# Altium schematic sheet FPGA_Project1.SchDoc
size A4
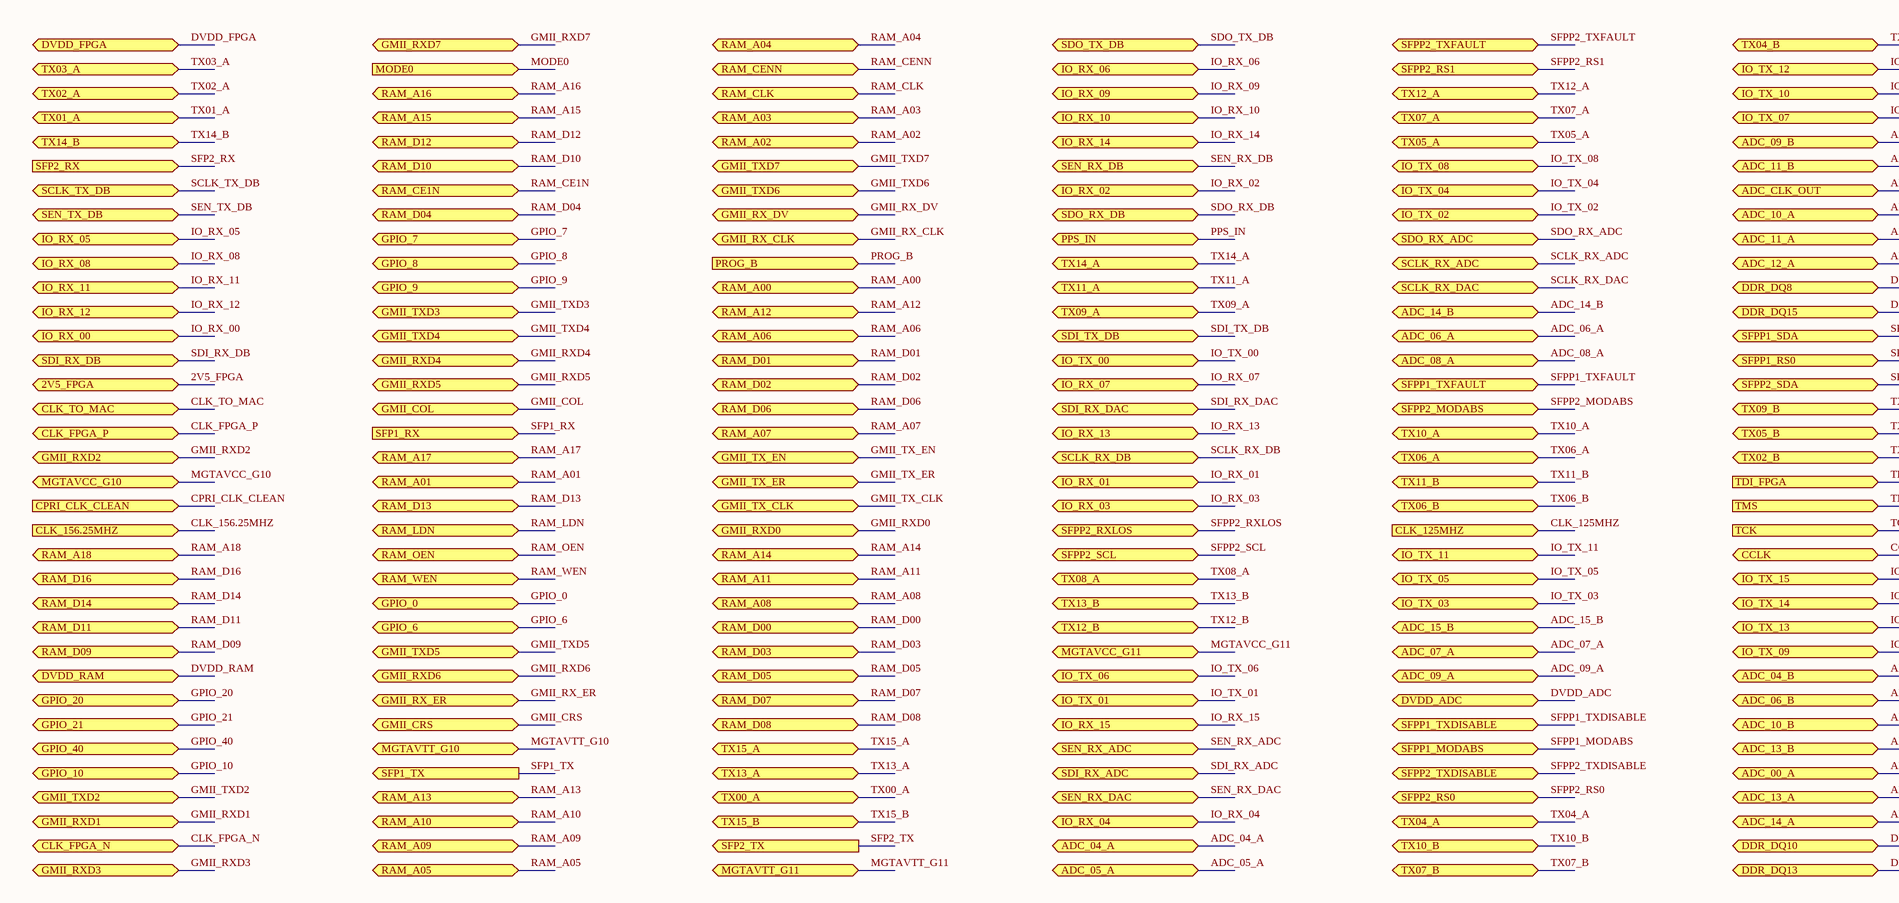
[diagram p0: FPGA_Project1.SchDoc, left]
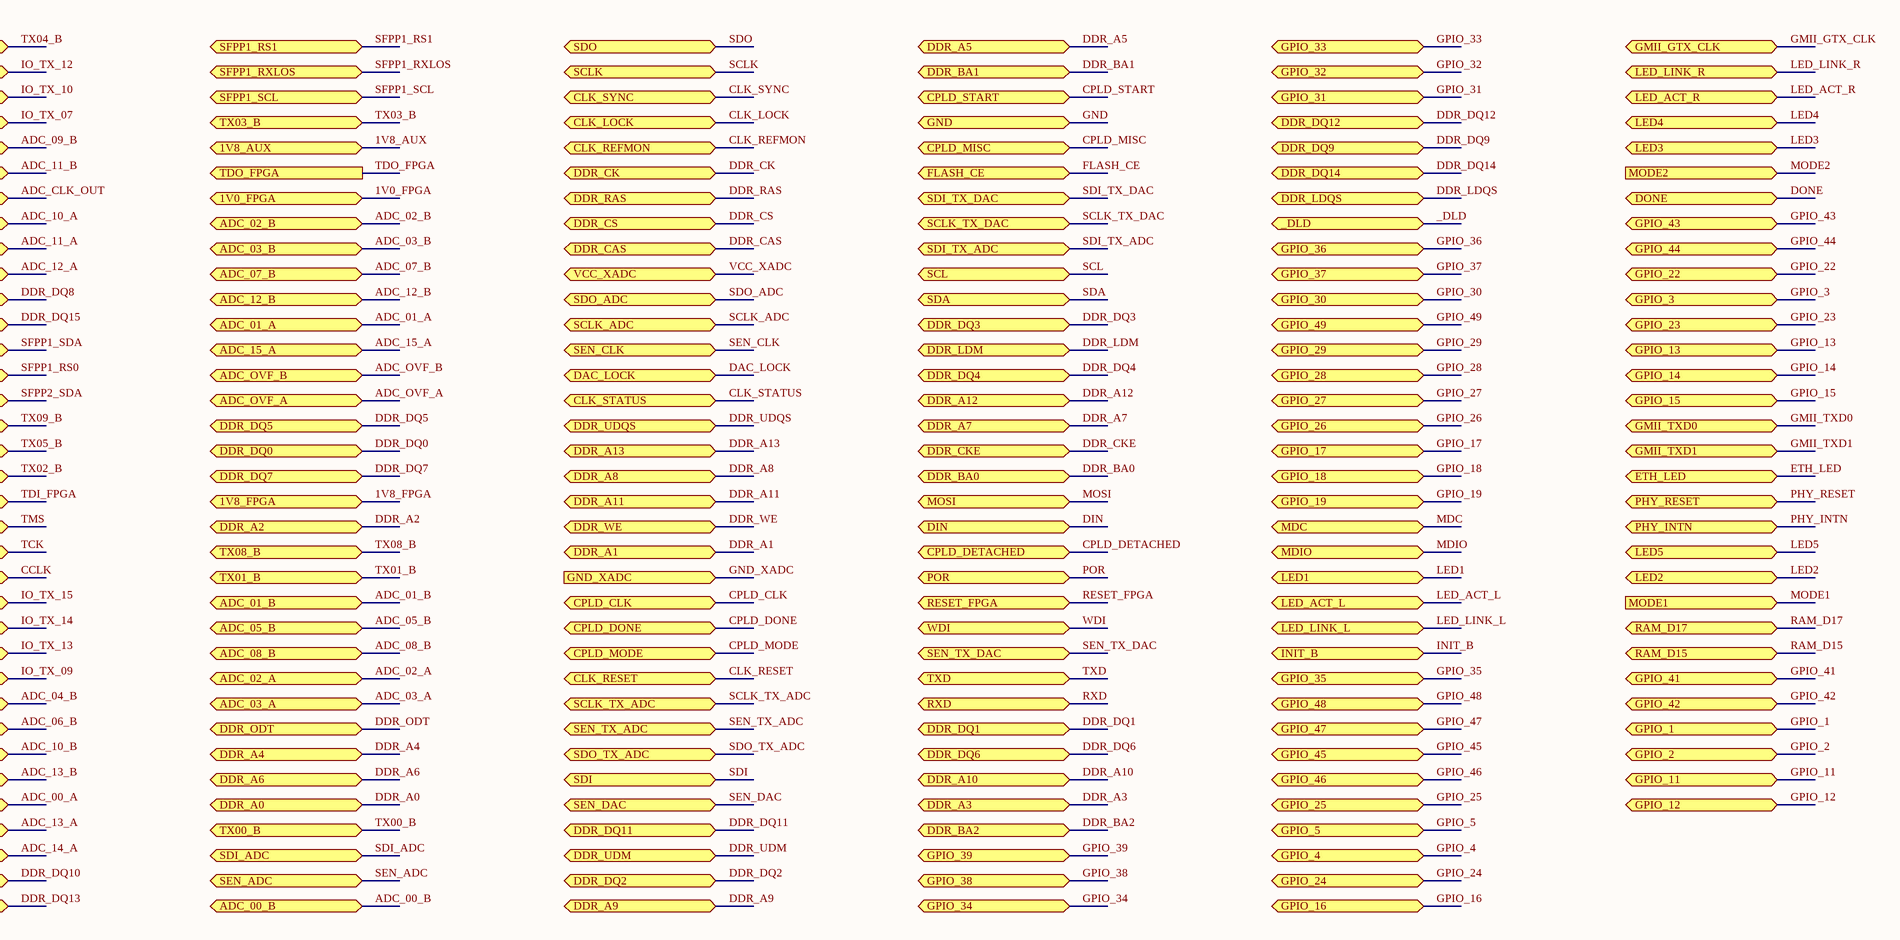
[diagram p1: FPGA_Project1.SchDoc, right]

## Ports
1V0_FPGA, 1V8_AUX, 1V8_FPGA, 2V5_FPGA, _DLD (bidir), ADC_00_A (bidir), ADC_00_B (bidir), ADC_01_A (bidir), ADC_01_B (bidir), ADC_02_A (bidir), ADC_02_B (bidir), ADC_03_A (bidir), ADC_03_B (bidir), ADC_04_A (bidir), ADC_04_B (bidir), ADC_05_A (bidir), ADC_05_B (bidir), ADC_06_A (bidir), ADC_06_B (bidir), ADC_07_A (bidir), ADC_07_B (bidir), ADC_08_A (bidir), ADC_08_B (bidir), ADC_09_A (bidir), ADC_09_B (bidir), ADC_10_A (bidir), ADC_10_B (bidir), ADC_11_A (bidir), ADC_11_B (bidir), ADC_12_A (bidir), ADC_12_B (bidir), ADC_13_A (bidir), ADC_13_B (bidir), ADC_14_A (bidir), ADC_14_B (bidir), ADC_15_A (bidir), ADC_15_B (bidir), ADC_CLK_OUT (bidir), ADC_OVF_A (bidir), ADC_OVF_B (bidir), CCLK (bidir), CLK_125MHZ (in), CLK_156.25MHZ (in), CLK_FPGA_N (bidir), CLK_FPGA_P (bidir), CLK_LOCK (bidir), CLK_REFMON (bidir), CLK_RESET (bidir), CLK_STATUS (bidir), CLK_SYNC (bidir), CLK_TO_MAC (bidir), CPLD_CLK (bidir), CPLD_DETACHED (bidir), CPLD_DONE (bidir), CPLD_MISC (bidir), CPLD_MODE (bidir), CPLD_START (bidir), CPRI_CLK_CLEAN (in), DAC_LOCK (bidir), DDR_A0 (bidir), DDR_A1 (bidir), DDR_A2 (bidir), DDR_A3 (bidir), DDR_A4 (bidir), DDR_A5 (bidir), DDR_A6 (bidir), DDR_A7 (bidir), DDR_A8 (bidir), DDR_A9 (bidir), DDR_A10 (bidir), DDR_A11 (bidir), DDR_A12 (bidir), DDR_A13 (bidir), DDR_BA0 (bidir), DDR_BA1 (bidir), DDR_BA2 (bidir), DDR_CAS (bidir), DDR_CK (bidir), DDR_CKE (bidir), DDR_CS (bidir), DDR_DQ0 (bidir), DDR_DQ1 (bidir), DDR_DQ2 (bidir), DDR_DQ3 (bidir), DDR_DQ4 (bidir), DDR_DQ5 (bidir), DDR_DQ6 (bidir), DDR_DQ7 (bidir), DDR_DQ8 (bidir), DDR_DQ9 (bidir), DDR_DQ10 (bidir), DDR_DQ11 (bidir), DDR_DQ12 (bidir), DDR_DQ13 (bidir), DDR_DQ14 (bidir), DDR_DQ15 (bidir), DDR_LDM (bidir), DDR_LDQS (bidir), DDR_ODT (bidir), DDR_RAS (bidir), DDR_UDM (bidir), DDR_UDQS (bidir), DDR_WE (bidir), DIN (bidir), DONE (bidir), DVDD_ADC, DVDD_FPGA, DVDD_RAM, ETH_LED (bidir), FLASH_CE (bidir), GMII_COL (bidir), GMII_CRS (bidir), GMII_GTX_CLK (bidir), GMII_RX_CLK (bidir), GMII_RX_DV (bidir), GMII_RX_ER (bidir), GMII_RXD0 (bidir), GMII_RXD1 (bidir), GMII_RXD2 (bidir), GMII_RXD3 (bidir), GMII_RXD4 (bidir), GMII_RXD5 (bidir), GMII_RXD6 (bidir), GMII_RXD7 (bidir), GMII_TX_CLK (bidir), GMII_TX_EN (bidir), GMII_TX_ER (bidir), GMII_TXD0 (bidir), GMII_TXD1 (bidir), GMII_TXD2 (bidir), GMII_TXD3 (bidir), GMII_TXD4 (bidir), GMII_TXD5 (bidir), GMII_TXD6 (bidir), GMII_TXD7 (bidir), GND (bidir), GND_XADC (in), GPIO_0 (bidir), GPIO_1 (bidir), GPIO_2 (bidir), GPIO_3 (bidir), GPIO_4 (bidir), GPIO_5 (bidir), GPIO_6 (bidir), GPIO_7 (bidir), GPIO_8 (bidir), GPIO_9 (bidir), GPIO_10 (bidir), GPIO_11 (bidir), GPIO_12 (bidir), GPIO_13 (bidir), GPIO_14 (bidir), GPIO_15 (bidir), GPIO_16 (bidir), GPIO_17 (bidir), GPIO_18 (bidir), GPIO_19 (bidir), GPIO_20 (bidir), GPIO_21 (bidir), GPIO_22 (bidir), GPIO_23 (bidir), GPIO_24 (bidir), GPIO_25 (bidir), GPIO_26 (bidir), GPIO_27 (bidir), GPIO_28 (bidir), GPIO_29 (bidir), GPIO_30 (bidir), GPIO_31 (bidir), GPIO_32 (bidir), GPIO_33 (bidir), GPIO_34 (bidir), GPIO_35 (bidir), GPIO_36 (bidir), GPIO_37 (bidir), GPIO_38 (bidir), GPIO_39 (bidir), GPIO_40 (bidir), GPIO_41 (bidir), GPIO_42 (bidir), GPIO_43 (bidir), GPIO_44 (bidir), GPIO_45 (bidir), GPIO_46 (bidir), GPIO_47 (bidir), GPIO_48 (bidir), GPIO_49 (bidir), INIT_B (bidir), IO_RX_00 (bidir), IO_RX_01 (bidir), IO_RX_02 (bidir), IO_RX_03 (bidir), IO_RX_04 (bidir), IO_RX_05 (bidir), IO_RX_06 (bidir), IO_RX_07 (bidir), IO_RX_08 (bidir), IO_RX_09 (bidir), IO_RX_10 (bidir), IO_RX_11 (bidir), IO_RX_12 (bidir), IO_RX_13 (bidir), IO_RX_14 (bidir), IO_RX_15 (bidir), IO_TX_00 (bidir), IO_TX_01 (bidir), IO_TX_02 (bidir), IO_TX_03 (bidir), IO_TX_04 (bidir), IO_TX_05 (bidir), IO_TX_06 (bidir), IO_TX_07 (bidir), IO_TX_08 (bidir), IO_TX_09 (bidir), IO_TX_10 (bidir), IO_TX_11 (bidir), IO_TX_12 (bidir), IO_TX_13 (bidir), IO_TX_14 (bidir), IO_TX_15 (bidir), LED1 (bidir), LED2 (bidir), LED3 (bidir), LED4 (bidir), LED5 (bidir), LED_ACT_L (bidir), LED_ACT_R (bidir), LED_LINK_L (bidir), LED_LINK_R (bidir), MDC (bidir), MDIO (bidir), MGTAVCC_G10, MGTAVCC_G11, MGTAVTT_G10, MGTAVTT_G11, MODE0 (in), MODE1 (in), MODE2 (in), MOSI (bidir), PHY_INTN (bidir), PHY_RESET (bidir), POR (bidir), PPS_IN (bidir), PROG_B (in), RAM_A00 (bidir), RAM_A01 (bidir), RAM_A02 (bidir), RAM_A03 (bidir), RAM_A04 (bidir), RAM_A05 (bidir), RAM_A06 (bidir), RAM_A07 (bidir), RAM_A08 (bidir), RAM_A09 (bidir), RAM_A10 (bidir), RAM_A11 (bidir), RAM_A12 (bidir), RAM_A13 (bidir), RAM_A14 (bidir), RAM_A15 (bidir), RAM_A16 (bidir), RAM_A17 (bidir), RAM_A18 (bidir), RAM_CE1N (bidir), RAM_CENN (bidir), RAM_CLK (bidir), RAM_D00 (bidir), RAM_D01 (bidir), RAM_D02 (bidir), RAM_D03 (bidir), RAM_D04 (bidir), RAM_D05 (bidir), RAM_D06 (bidir), RAM_D07 (bidir), RAM_D08 (bidir), RAM_D09 (bidir), RAM_D10 (bidir), RAM_D11 (bidir), RAM_D12 (bidir), RAM_D13 (bidir), RAM_D14 (bidir), RAM_D15 (bidir), RAM_D16 (bidir), RAM_D17 (bidir), RAM_LDN (bidir), RAM_OEN (bidir), RAM_WEN (bidir), RESET_FPGA (bidir), RXD (bidir), SCL (bidir), SCLK (bidir), SCLK_ADC (bidir), SCLK_RX_ADC (bidir), SCLK_RX_DAC (bidir), SCLK_RX_DB (bidir), SCLK_TX_ADC (bidir), SCLK_TX_DAC (bidir), SCLK_TX_DB (bidir), SDA (bidir), SDI (bidir), SDI_ADC (bidir), SDI_RX_ADC (bidir), SDI_RX_DAC (bidir), SDI_RX_DB (bidir), SDI_TX_ADC (bidir), SDI_TX_DAC (bidir), SDI_TX_DB (bidir), SDO (bidir), SDO_ADC (bidir), SDO_RX_ADC (bidir), SDO_RX_DB (bidir), SDO_TX_ADC (bidir), SDO_TX_DB (bidir), SEN_ADC (bidir), SEN_CLK (bidir), SEN_DAC (bidir), SEN_RX_ADC (bidir), SEN_RX_DAC (bidir), SEN_RX_DB (bidir), SEN_TX_ADC (bidir), SEN_TX_DAC (bidir), SEN_TX_DB (bidir), SFP1_RX (in), SFP1_TX (out), SFP2_RX (in), SFP2_TX (out), SFPP1_MODABS (bidir), SFPP1_RS0 (bidir), SFPP1_RS1 (bidir), SFPP1_RXLOS (bidir), SFPP1_SCL (bidir), SFPP1_SDA (bidir), SFPP1_TXDISABLE (bidir), SFPP1_TXFAULT (bidir), SFPP2_MODABS (bidir), SFPP2_RS0 (bidir), SFPP2_RS1 (bidir), SFPP2_RXLOS (bidir), SFPP2_SCL (bidir), SFPP2_SDA (bidir), SFPP2_TXDISABLE (bidir), SFPP2_TXFAULT (bidir), TCK (in), TDI_FPGA (in), TDO_FPGA (out), TMS (in), TX00_A (bidir), TX00_B (bidir), TX01_A (bidir), TX01_B (bidir), TX02_A (bidir), TX02_B (bidir), TX03_A (bidir), TX03_B (bidir), TX04_A (bidir), TX04_B (bidir), TX05_A (bidir), TX05_B (bidir), TX06_A (bidir), TX06_B (bidir), TX07_A (bidir), TX07_B (bidir), TX08_A (bidir), TX08_B (bidir), TX09_A (bidir), TX09_B (bidir), TX10_A (bidir), TX10_B (bidir), TX11_A (bidir), TX11_B (bidir), TX12_A (bidir), TX12_B (bidir), TX13_A (bidir), TX13_B (bidir), TX14_A (bidir), TX14_B (bidir), TX15_A (bidir), TX15_B (bidir), TXD (bidir), VCC_XADC, WDI (bidir)

## Nets
1V0_FPGA: port 1V0_FPGA
1V8_AUX: port 1V8_AUX
1V8_FPGA: port 1V8_FPGA
2V5_FPGA: port 2V5_FPGA
_DLD: port _DLD
ADC_00_A: port ADC_00_A
ADC_00_B: port ADC_00_B
ADC_01_A: port ADC_01_A
ADC_01_B: port ADC_01_B
ADC_02_A: port ADC_02_A
ADC_02_B: port ADC_02_B
ADC_03_A: port ADC_03_A
ADC_03_B: port ADC_03_B
ADC_04_A: port ADC_04_A
ADC_04_B: port ADC_04_B
ADC_05_A: port ADC_05_A
ADC_05_B: port ADC_05_B
ADC_06_A: port ADC_06_A
ADC_06_B: port ADC_06_B
ADC_07_A: port ADC_07_A
ADC_07_B: port ADC_07_B
ADC_08_A: port ADC_08_A
ADC_08_B: port ADC_08_B
ADC_09_A: port ADC_09_A
ADC_09_B: port ADC_09_B
ADC_10_A: port ADC_10_A
ADC_10_B: port ADC_10_B
ADC_11_A: port ADC_11_A
ADC_11_B: port ADC_11_B
ADC_12_A: port ADC_12_A
ADC_12_B: port ADC_12_B
ADC_13_A: port ADC_13_A
ADC_13_B: port ADC_13_B
ADC_14_A: port ADC_14_A
ADC_14_B: port ADC_14_B
ADC_15_A: port ADC_15_A
ADC_15_B: port ADC_15_B
ADC_CLK_OUT: port ADC_CLK_OUT
ADC_OVF_A: port ADC_OVF_A
ADC_OVF_B: port ADC_OVF_B
CCLK: port CCLK
CLK_125MHZ: port CLK_125MHZ
CLK_156.25MHZ: port CLK_156.25MHZ
CLK_FPGA_N: port CLK_FPGA_N
CLK_FPGA_P: port CLK_FPGA_P
CLK_LOCK: port CLK_LOCK
CLK_REFMON: port CLK_REFMON
CLK_RESET: port CLK_RESET
CLK_STATUS: port CLK_STATUS
CLK_SYNC: port CLK_SYNC
CLK_TO_MAC: port CLK_TO_MAC
CPLD_CLK: port CPLD_CLK
CPLD_DETACHED: port CPLD_DETACHED
CPLD_DONE: port CPLD_DONE
CPLD_MISC: port CPLD_MISC
CPLD_MODE: port CPLD_MODE
CPLD_START: port CPLD_START
CPRI_CLK_CLEAN: port CPRI_CLK_CLEAN
DAC_LOCK: port DAC_LOCK
DDR_A0: port DDR_A0
DDR_A1: port DDR_A1
DDR_A2: port DDR_A2
DDR_A3: port DDR_A3
DDR_A4: port DDR_A4
DDR_A5: port DDR_A5
DDR_A6: port DDR_A6
DDR_A7: port DDR_A7
DDR_A8: port DDR_A8
DDR_A9: port DDR_A9
DDR_A10: port DDR_A10
DDR_A11: port DDR_A11
DDR_A12: port DDR_A12
DDR_A13: port DDR_A13
DDR_BA0: port DDR_BA0
DDR_BA1: port DDR_BA1
DDR_BA2: port DDR_BA2
DDR_CAS: port DDR_CAS
DDR_CK: port DDR_CK
DDR_CKE: port DDR_CKE
DDR_CS: port DDR_CS
DDR_DQ0: port DDR_DQ0
DDR_DQ1: port DDR_DQ1
DDR_DQ2: port DDR_DQ2
DDR_DQ3: port DDR_DQ3
DDR_DQ4: port DDR_DQ4
DDR_DQ5: port DDR_DQ5
DDR_DQ6: port DDR_DQ6
DDR_DQ7: port DDR_DQ7
DDR_DQ8: port DDR_DQ8
DDR_DQ9: port DDR_DQ9
DDR_DQ10: port DDR_DQ10
DDR_DQ11: port DDR_DQ11
DDR_DQ12: port DDR_DQ12
DDR_DQ13: port DDR_DQ13
DDR_DQ14: port DDR_DQ14
DDR_DQ15: port DDR_DQ15
DDR_LDM: port DDR_LDM
DDR_LDQS: port DDR_LDQS
DDR_ODT: port DDR_ODT
DDR_RAS: port DDR_RAS
DDR_UDM: port DDR_UDM
DDR_UDQS: port DDR_UDQS
DDR_WE: port DDR_WE
DIN: port DIN
DONE: port DONE
DVDD_ADC: port DVDD_ADC
DVDD_FPGA: port DVDD_FPGA
DVDD_RAM: port DVDD_RAM
ETH_LED: port ETH_LED
FLASH_CE: port FLASH_CE
GMII_COL: port GMII_COL
GMII_CRS: port GMII_CRS
GMII_GTX_CLK: port GMII_GTX_CLK
GMII_RX_CLK: port GMII_RX_CLK
GMII_RX_DV: port GMII_RX_DV
GMII_RX_ER: port GMII_RX_ER
GMII_RXD0: port GMII_RXD0
GMII_RXD1: port GMII_RXD1
GMII_RXD2: port GMII_RXD2
GMII_RXD3: port GMII_RXD3
GMII_RXD4: port GMII_RXD4
GMII_RXD5: port GMII_RXD5
GMII_RXD6: port GMII_RXD6
GMII_RXD7: port GMII_RXD7
GMII_TX_CLK: port GMII_TX_CLK
GMII_TX_EN: port GMII_TX_EN
GMII_TX_ER: port GMII_TX_ER
GMII_TXD0: port GMII_TXD0
GMII_TXD1: port GMII_TXD1
GMII_TXD2: port GMII_TXD2
GMII_TXD3: port GMII_TXD3
GMII_TXD4: port GMII_TXD4
GMII_TXD5: port GMII_TXD5
GMII_TXD6: port GMII_TXD6
GMII_TXD7: port GMII_TXD7
GND: port GND
GND_XADC: port GND_XADC
GPIO_0: port GPIO_0
GPIO_1: port GPIO_1
GPIO_2: port GPIO_2
GPIO_3: port GPIO_3
GPIO_4: port GPIO_4
GPIO_5: port GPIO_5
GPIO_6: port GPIO_6
GPIO_7: port GPIO_7
GPIO_8: port GPIO_8
GPIO_9: port GPIO_9
GPIO_10: port GPIO_10
GPIO_11: port GPIO_11
GPIO_12: port GPIO_12
GPIO_13: port GPIO_13
GPIO_14: port GPIO_14
GPIO_15: port GPIO_15
GPIO_16: port GPIO_16
GPIO_17: port GPIO_17
GPIO_18: port GPIO_18
GPIO_19: port GPIO_19
GPIO_20: port GPIO_20
GPIO_21: port GPIO_21
GPIO_22: port GPIO_22
GPIO_23: port GPIO_23
GPIO_24: port GPIO_24
GPIO_25: port GPIO_25
GPIO_26: port GPIO_26
GPIO_27: port GPIO_27
GPIO_28: port GPIO_28
GPIO_29: port GPIO_29
GPIO_30: port GPIO_30
GPIO_31: port GPIO_31
GPIO_32: port GPIO_32
GPIO_33: port GPIO_33
GPIO_34: port GPIO_34
GPIO_35: port GPIO_35
GPIO_36: port GPIO_36
GPIO_37: port GPIO_37
GPIO_38: port GPIO_38
GPIO_39: port GPIO_39
GPIO_40: port GPIO_40
GPIO_41: port GPIO_41
GPIO_42: port GPIO_42
GPIO_43: port GPIO_43
GPIO_44: port GPIO_44
GPIO_45: port GPIO_45
GPIO_46: port GPIO_46
GPIO_47: port GPIO_47
GPIO_48: port GPIO_48
GPIO_49: port GPIO_49
INIT_B: port INIT_B
IO_RX_00: port IO_RX_00
IO_RX_01: port IO_RX_01
IO_RX_02: port IO_RX_02
IO_RX_03: port IO_RX_03
IO_RX_04: port IO_RX_04
IO_RX_05: port IO_RX_05
IO_RX_06: port IO_RX_06
IO_RX_07: port IO_RX_07
IO_RX_08: port IO_RX_08
IO_RX_09: port IO_RX_09
IO_RX_10: port IO_RX_10
IO_RX_11: port IO_RX_11
IO_RX_12: port IO_RX_12
IO_RX_13: port IO_RX_13
IO_RX_14: port IO_RX_14
IO_RX_15: port IO_RX_15
IO_TX_00: port IO_TX_00
IO_TX_01: port IO_TX_01
IO_TX_02: port IO_TX_02
IO_TX_03: port IO_TX_03
IO_TX_04: port IO_TX_04
IO_TX_05: port IO_TX_05
IO_TX_06: port IO_TX_06
IO_TX_07: port IO_TX_07
IO_TX_08: port IO_TX_08
IO_TX_09: port IO_TX_09
IO_TX_10: port IO_TX_10
IO_TX_11: port IO_TX_11
IO_TX_12: port IO_TX_12
IO_TX_13: port IO_TX_13
IO_TX_14: port IO_TX_14
IO_TX_15: port IO_TX_15
LED1: port LED1
LED2: port LED2
LED3: port LED3
LED4: port LED4
LED5: port LED5
LED_ACT_L: port LED_ACT_L
LED_ACT_R: port LED_ACT_R
LED_LINK_L: port LED_LINK_L
LED_LINK_R: port LED_LINK_R
MDC: port MDC
MDIO: port MDIO
MGTAVCC_G10: port MGTAVCC_G10
MGTAVCC_G11: port MGTAVCC_G11
MGTAVTT_G10: port MGTAVTT_G10
MGTAVTT_G11: port MGTAVTT_G11
MODE0: port MODE0
MODE1: port MODE1
MODE2: port MODE2
MOSI: port MOSI
PHY_INTN: port PHY_INTN
PHY_RESET: port PHY_RESET
POR: port POR
PPS_IN: port PPS_IN
PROG_B: port PROG_B
RAM_A00: port RAM_A00
RAM_A01: port RAM_A01
RAM_A02: port RAM_A02
RAM_A03: port RAM_A03
RAM_A04: port RAM_A04
RAM_A05: port RAM_A05
RAM_A06: port RAM_A06
RAM_A07: port RAM_A07
RAM_A08: port RAM_A08
RAM_A09: port RAM_A09
RAM_A10: port RAM_A10
RAM_A11: port RAM_A11
RAM_A12: port RAM_A12
RAM_A13: port RAM_A13
RAM_A14: port RAM_A14
RAM_A15: port RAM_A15
RAM_A16: port RAM_A16
RAM_A17: port RAM_A17
RAM_A18: port RAM_A18
RAM_CE1N: port RAM_CE1N
RAM_CENN: port RAM_CENN
RAM_CLK: port RAM_CLK
RAM_D00: port RAM_D00
RAM_D01: port RAM_D01
RAM_D02: port RAM_D02
RAM_D03: port RAM_D03
RAM_D04: port RAM_D04
RAM_D05: port RAM_D05
RAM_D06: port RAM_D06
RAM_D07: port RAM_D07
RAM_D08: port RAM_D08
RAM_D09: port RAM_D09
RAM_D10: port RAM_D10
RAM_D11: port RAM_D11
RAM_D12: port RAM_D12
RAM_D13: port RAM_D13
RAM_D14: port RAM_D14
RAM_D15: port RAM_D15
RAM_D16: port RAM_D16
RAM_D17: port RAM_D17
RAM_LDN: port RAM_LDN
RAM_OEN: port RAM_OEN
RAM_WEN: port RAM_WEN
RESET_FPGA: port RESET_FPGA
RXD: port RXD
SCL: port SCL
SCLK: port SCLK
SCLK_ADC: port SCLK_ADC
SCLK_RX_ADC: port SCLK_RX_ADC
SCLK_RX_DAC: port SCLK_RX_DAC
SCLK_RX_DB: port SCLK_RX_DB
SCLK_TX_ADC: port SCLK_TX_ADC
SCLK_TX_DAC: port SCLK_TX_DAC
SCLK_TX_DB: port SCLK_TX_DB
SDA: port SDA
SDI: port SDI
SDI_ADC: port SDI_ADC
SDI_RX_ADC: port SDI_RX_ADC
SDI_RX_DAC: port SDI_RX_DAC
SDI_RX_DB: port SDI_RX_DB
SDI_TX_ADC: port SDI_TX_ADC
SDI_TX_DAC: port SDI_TX_DAC
SDI_TX_DB: port SDI_TX_DB
SDO: port SDO
SDO_ADC: port SDO_ADC
SDO_RX_ADC: port SDO_RX_ADC
SDO_RX_DB: port SDO_RX_DB
SDO_TX_ADC: port SDO_TX_ADC
SDO_TX_DB: port SDO_TX_DB
SEN_ADC: port SEN_ADC
SEN_CLK: port SEN_CLK
SEN_DAC: port SEN_DAC
SEN_RX_ADC: port SEN_RX_ADC
SEN_RX_DAC: port SEN_RX_DAC
SEN_RX_DB: port SEN_RX_DB
SEN_TX_ADC: port SEN_TX_ADC
SEN_TX_DAC: port SEN_TX_DAC
SEN_TX_DB: port SEN_TX_DB
SFP1_RX: port SFP1_RX
SFP1_TX: port SFP1_TX
SFP2_RX: port SFP2_RX
SFP2_TX: port SFP2_TX
SFPP1_MODABS: port SFPP1_MODABS
SFPP1_RS0: port SFPP1_RS0
SFPP1_RS1: port SFPP1_RS1
SFPP1_RXLOS: port SFPP1_RXLOS
SFPP1_SCL: port SFPP1_SCL
SFPP1_SDA: port SFPP1_SDA
SFPP1_TXDISABLE: port SFPP1_TXDISABLE
SFPP1_TXFAULT: port SFPP1_TXFAULT
SFPP2_MODABS: port SFPP2_MODABS
SFPP2_RS0: port SFPP2_RS0
SFPP2_RS1: port SFPP2_RS1
SFPP2_RXLOS: port SFPP2_RXLOS
SFPP2_SCL: port SFPP2_SCL
SFPP2_SDA: port SFPP2_SDA
SFPP2_TXDISABLE: port SFPP2_TXDISABLE
SFPP2_TXFAULT: port SFPP2_TXFAULT
TCK: port TCK
TDI_FPGA: port TDI_FPGA
TDO_FPGA: port TDO_FPGA
TMS: port TMS
TX00_A: port TX00_A
TX00_B: port TX00_B
TX01_A: port TX01_A
TX01_B: port TX01_B
TX02_A: port TX02_A
TX02_B: port TX02_B
TX03_A: port TX03_A
TX03_B: port TX03_B
TX04_A: port TX04_A
TX04_B: port TX04_B
TX05_A: port TX05_A
TX05_B: port TX05_B
TX06_A: port TX06_A
TX06_B: port TX06_B
TX07_A: port TX07_A
TX07_B: port TX07_B
TX08_A: port TX08_A
TX08_B: port TX08_B
TX09_A: port TX09_A
TX09_B: port TX09_B
TX10_A: port TX10_A
TX10_B: port TX10_B
TX11_A: port TX11_A
TX11_B: port TX11_B
TX12_A: port TX12_A
TX12_B: port TX12_B
TX13_A: port TX13_A
TX13_B: port TX13_B
TX14_A: port TX14_A
TX14_B: port TX14_B
TX15_A: port TX15_A
TX15_B: port TX15_B
TXD: port TXD
VCC_XADC: port VCC_XADC
WDI: port WDI